# Altium schematic sheet DAC.SchDoc
size 558 x 431 mm; SheetNumber: 12; SheetTotal: 25; Sheet_Name: DAC; Size: 11x17
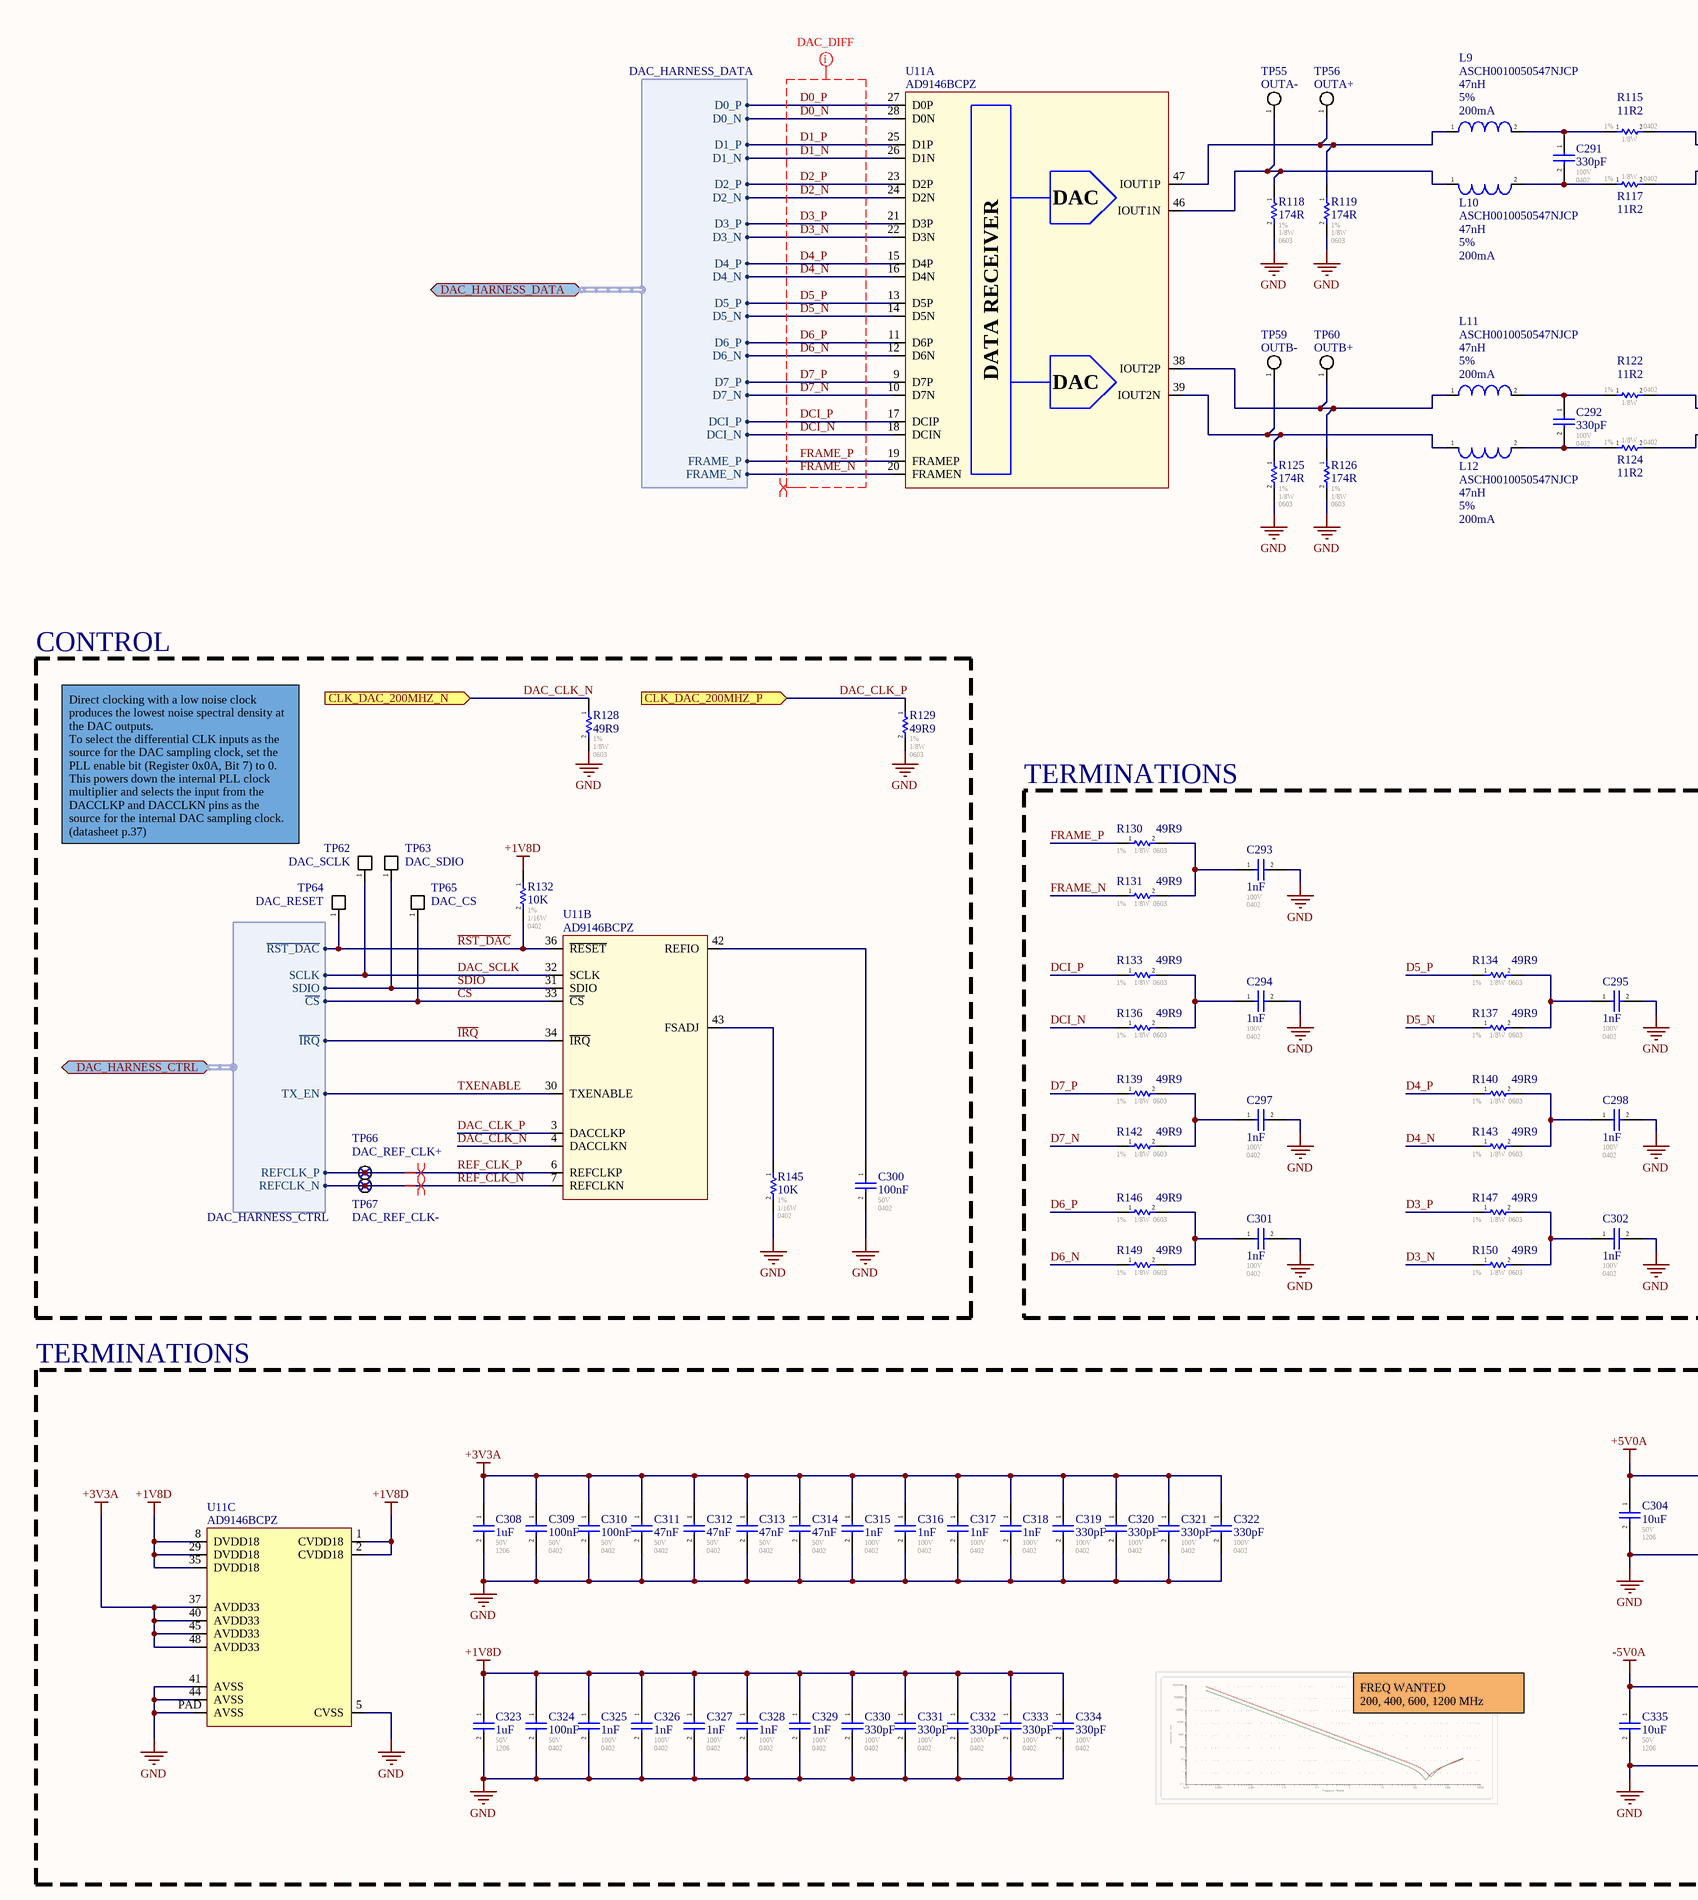
[diagram p0: DAC.SchDoc, left]
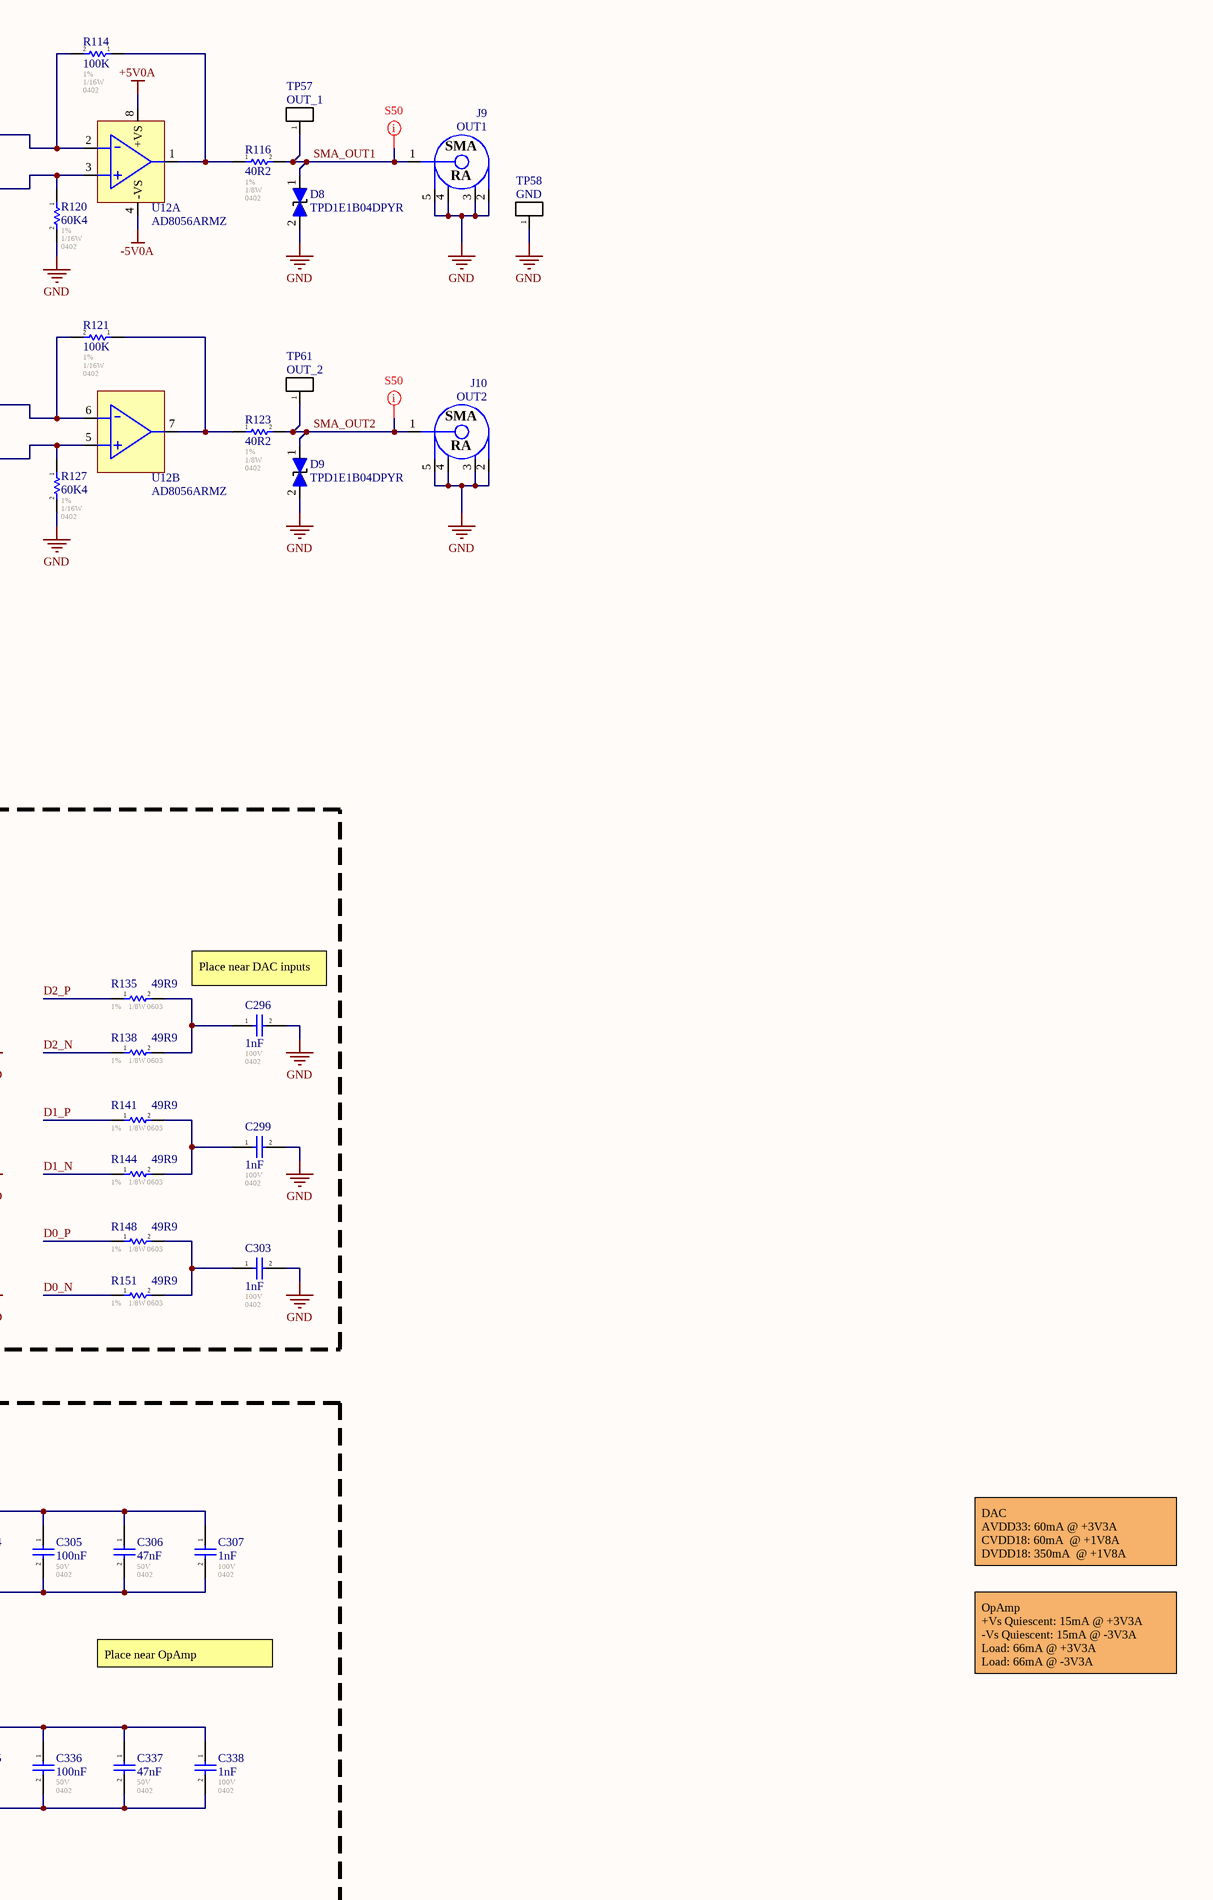
[diagram p1: DAC.SchDoc, right]

## Parts
C291  330pF  Voltage - Rated: 100V  Footprint: 0402  [CAP_0402]
C292  330pF  Voltage - Rated: 100V  Footprint: 0402  [CAP_0402]
C293  1nF  Voltage - Rated: 100V  Footprint: 0402  [CAP_0402]
C294  1nF  Voltage - Rated: 100V  Footprint: 0402  [CAP_0402]
C295  1nF  Voltage - Rated: 100V  Footprint: 0402  [CAP_0402]
C296  1nF  Voltage - Rated: 100V  Footprint: 0402  [CAP_0402]
C297  1nF  Voltage - Rated: 100V  Footprint: 0402  [CAP_0402]
C298  1nF  Voltage - Rated: 100V  Footprint: 0402  [CAP_0402]
C299  1nF  Voltage - Rated: 100V  Footprint: 0402  [CAP_0402]
C300  100nF  Voltage - Rated: 50V  Footprint: 0402  [CAP_0402]
C301  1nF  Voltage - Rated: 100V  Footprint: 0402  [CAP_0402]
C302  1nF  Voltage - Rated: 100V  Footprint: 0402  [CAP_0402]
C303  1nF  Voltage - Rated: 100V  Footprint: 0402  [CAP_0402]
C304  10uF  Voltage - Rated: 50V  Footprint: 1206  [CAP_1206]
C305  100nF  Voltage - Rated: 50V  Footprint: 0402  [CAP_0402]
C306  47nF  Voltage - Rated: 50V  Footprint: 0402  [CAP_0402]
C307  1nF  Voltage - Rated: 100V  Footprint: 0402  [CAP_0402]
C308  1uF  Voltage - Rated: 50V  Footprint: 1206  [CAP_1206]
C309  100nF  Voltage - Rated: 50V  Footprint: 0402  [CAP_0402]
C310  100nF  Voltage - Rated: 50V  Footprint: 0402  [CAP_0402]
C311  47nF  Voltage - Rated: 50V  Footprint: 0402  [CAP_0402]
C312  47nF  Voltage - Rated: 50V  Footprint: 0402  [CAP_0402]
C313  47nF  Voltage - Rated: 50V  Footprint: 0402  [CAP_0402]
C314  47nF  Voltage - Rated: 50V  Footprint: 0402  [CAP_0402]
C315  1nF  Voltage - Rated: 100V  Footprint: 0402  [CAP_0402]
C316  1nF  Voltage - Rated: 100V  Footprint: 0402  [CAP_0402]
C317  1nF  Voltage - Rated: 100V  Footprint: 0402  [CAP_0402]
C318  1nF  Voltage - Rated: 100V  Footprint: 0402  [CAP_0402]
C319  330pF  Voltage - Rated: 100V  Footprint: 0402  [CAP_0402]
C320  330pF  Voltage - Rated: 100V  Footprint: 0402  [CAP_0402]
C321  330pF  Voltage - Rated: 100V  Footprint: 0402  [CAP_0402]
C322  330pF  Voltage - Rated: 100V  Footprint: 0402  [CAP_0402]
C323  1uF  Voltage - Rated: 50V  Footprint: 1206  [CAP_1206]
C324  100nF  Voltage - Rated: 50V  Footprint: 0402  [CAP_0402]
C325  1nF  Voltage - Rated: 100V  Footprint: 0402  [CAP_0402]
C326  1nF  Voltage - Rated: 100V  Footprint: 0402  [CAP_0402]
C327  1nF  Voltage - Rated: 100V  Footprint: 0402  [CAP_0402]
C328  1nF  Voltage - Rated: 100V  Footprint: 0402  [CAP_0402]
C329  1nF  Voltage - Rated: 100V  Footprint: 0402  [CAP_0402]
C330  330pF  Voltage - Rated: 100V  Footprint: 0402  [CAP_0402]
C331  330pF  Voltage - Rated: 100V  Footprint: 0402  [CAP_0402]
C332  330pF  Voltage - Rated: 100V  Footprint: 0402  [CAP_0402]
C333  330pF  Voltage - Rated: 100V  Footprint: 0402  [CAP_0402]
C334  330pF  Voltage - Rated: 100V  Footprint: 0402  [CAP_0402]
C335  10uF  Voltage - Rated: 50V  Footprint: 1206  [CAP_1206]
C336  100nF  Voltage - Rated: 50V  Footprint: 0402  [CAP_0402]
C337  47nF  Voltage - Rated: 50V  Footprint: 0402  [CAP_0402]
C338  1nF  Voltage - Rated: 100V  Footprint: 0402  [CAP_0402]
D8  TPD1E1B04DPYR  [TVS_DATA_TPD1E1B04DPYR]
D9  TPD1E1B04DPYR  [TVS_DATA_TPD1E1B04DPYR]
J9  OUT1  [CONN_SMA_5-1814400-1]
J10  OUT2  [CONN_SMA_5-1814400-1]
L9  ASCH0010050547NJCP  Inductance: 47nH  Tolerance: 5%  Current Rating: 200mA  [IND_0402]
L10  ASCH0010050547NJCP  Inductance: 47nH  Tolerance: 5%  Current Rating: 200mA  [IND_0402]
L11  ASCH0010050547NJCP  Inductance: 47nH  Tolerance: 5%  Current Rating: 200mA  [IND_0402]
L12  ASCH0010050547NJCP  Inductance: 47nH  Tolerance: 5%  Current Rating: 200mA  [IND_0402]
R114  100K  Tolerance: 1%  Power: 1/16W  Package / Case: 0402  [RES_0402]
R115  11R2  Tolerance: 1%  Power: 1/8W  Package / Case: 0402  [RES_0402]
R116  40R2  Tolerance: 1%  Power: 1/8W  Package / Case: 0402  [RES_0402]
R117  11R2  Tolerance: 1%  Power: 1/8W  Package / Case: 0402  [RES_0402]
R118  174R  Tolerance: 1%  Power: 1/8W  Package / Case: 0603  [RES_0603]
R119  174R  Tolerance: 1%  Power: 1/8W  Package / Case: 0603  [RES_0603]
R120  60K4  Tolerance: 1%  Power: 1/16W  Package / Case: 0402  [RES_0402]
R121  100K  Tolerance: 1%  Power: 1/16W  Package / Case: 0402  [RES_0402]
R122  11R2  Tolerance: 1%  Power: 1/8W  Package / Case: 0402  [RES_0402]
R123  40R2  Tolerance: 1%  Power: 1/8W  Package / Case: 0402  [RES_0402]
R124  11R2  Tolerance: 1%  Power: 1/8W  Package / Case: 0402  [RES_0402]
R125  174R  Tolerance: 1%  Power: 1/8W  Package / Case: 0603  [RES_0603]
R126  174R  Tolerance: 1%  Power: 1/8W  Package / Case: 0603  [RES_0603]
R127  60K4  Tolerance: 1%  Power: 1/16W  Package / Case: 0402  [RES_0402]
R128  49R9  Tolerance: 1%  Power: 1/8W  Package / Case: 0603  [RES_0603]
R129  49R9  Tolerance: 1%  Power: 1/8W  Package / Case: 0603  [RES_0603]
R130  49R9  Tolerance: 1%  Power: 1/8W  Package / Case: 0603  [RES_0603]
R131  49R9  Tolerance: 1%  Power: 1/8W  Package / Case: 0603  [RES_0603]
R132  10K  Tolerance: 1%  Power: 1/16W  Package / Case: 0402  [RES_0402]
R133  49R9  Tolerance: 1%  Power: 1/8W  Package / Case: 0603  [RES_0603]
R134  49R9  Tolerance: 1%  Power: 1/8W  Package / Case: 0603  [RES_0603]
R135  49R9  Tolerance: 1%  Power: 1/8W  Package / Case: 0603  [RES_0603]
R136  49R9  Tolerance: 1%  Power: 1/8W  Package / Case: 0603  [RES_0603]
R137  49R9  Tolerance: 1%  Power: 1/8W  Package / Case: 0603  [RES_0603]
R138  49R9  Tolerance: 1%  Power: 1/8W  Package / Case: 0603  [RES_0603]
R139  49R9  Tolerance: 1%  Power: 1/8W  Package / Case: 0603  [RES_0603]
R140  49R9  Tolerance: 1%  Power: 1/8W  Package / Case: 0603  [RES_0603]
R141  49R9  Tolerance: 1%  Power: 1/8W  Package / Case: 0603  [RES_0603]
R142  49R9  Tolerance: 1%  Power: 1/8W  Package / Case: 0603  [RES_0603]
R143  49R9  Tolerance: 1%  Power: 1/8W  Package / Case: 0603  [RES_0603]
R144  49R9  Tolerance: 1%  Power: 1/8W  Package / Case: 0603  [RES_0603]
R145  10K  Tolerance: 1%  Power: 1/16W  Package / Case: 0402  [RES_0402]
R146  49R9  Tolerance: 1%  Power: 1/8W  Package / Case: 0603  [RES_0603]
R147  49R9  Tolerance: 1%  Power: 1/8W  Package / Case: 0603  [RES_0603]
R148  49R9  Tolerance: 1%  Power: 1/8W  Package / Case: 0603  [RES_0603]
R149  49R9  Tolerance: 1%  Power: 1/8W  Package / Case: 0603  [RES_0603]
R150  49R9  Tolerance: 1%  Power: 1/8W  Package / Case: 0603  [RES_0603]
R151  49R9  Tolerance: 1%  Power: 1/8W  Package / Case: 0603  [RES_0603]
TP55  OUTA-  [TP_PAD_SMALL]  (no BOM)
TP56  OUTA+  [TP_PAD_SMALL]  (no BOM)
TP57  OUT_1  [TP_HOLE]  (no BOM)
TP58  GND  [TP_HOLE]  (no BOM)
TP59  OUTB-  [TP_PAD_SMALL]  (no BOM)
TP60  OUTB+  [TP_PAD_SMALL]  (no BOM)
TP61  OUT_2  [TP_HOLE]  (no BOM)
TP62  DAC_SCLK  [TP_PAD]  (no BOM)
TP63  DAC_SDIO  [TP_PAD]  (no BOM)
TP64  DAC_RESET  [TP_PAD]  (no BOM)
TP65  DAC_CS  [TP_PAD]  (no BOM)
TP66  DAC_REF_CLK+  [TP_PAD_TINY]  (no BOM)
TP67  DAC_REF_CLK-  [TP_PAD_TINY]  (no BOM)
U11  AD9146BCPZ  [DAC_AD9146BCPZ]  (parts A,B,C of 3)
U12  AD8056ARMZ  [OPAMP_AD8056ARMZ]  (parts A,B of 2)

## Blocks framed on the sheet
CONTROL: C300 R128 R129 R132 R145 TP62-TP67 U11
TERMINATIONS: C293-C299 C301-C303 R130 R131 R133-R144 R146-R151
TERMINATIONS: C304-C338 U11

## Ports
CLK_DAC_200MHZ_N (in), CLK_DAC_200MHZ_P (in), DAC_HARNESS_CTRL (bidir, harness DAC_HARNESS_CTRL), DAC_HARNESS_DATA (bidir, harness DAC_HARNESS_DATA)

## Harnesses
DAC_HARNESS_DATA: D0_N, D0_P, D1_P, D1_N, D2_P, D2_N, D3_P, D3_N, D4_P, D4_N, D5_P, D5_N, D6_P, D6_N, D7_P, D7_N, DCI_P, DCI_N, FRAME_P, FRAME_N
DAC_HARNESS_CTRL: ~{RST_DAC}, SCLK, SDIO, ~{CS}, ~{IRQ}, TX_EN, REFCLK_P, REFCLK_N

## Nets
+1V8D: C323.1 C324.1 C325.1 C326.1 C327.1 C328.1 C329.1 C330.1 C331.1 C332.1 C333.1 C334.1 R132.1 U11.1(CVDD18) U11.2(CVDD18) U11.8(DVDD18) U11.29(DVDD18) U11.35(DVDD18)
+3V3A: C308.1 C309.1 C310.1 C311.1 C312.1 C313.1 C314.1 C315.1 C316.1 C317.1 C318.1 C319.1 C320.1 C321.1 C322.1 U11.37(AVDD33) U11.40(AVDD33) U11.45(AVDD33) U11.48(AVDD33)
+5V0A: C304.1 C305.1 C306.1 C307.1 U12.8(+VS)
-5V0A: C335.1 C336.1 C337.1 C338.1 U12.4(-VS)
GND: C293.2 C294.2 C295.2 C296.2 C297.2 C298.2 C299.2 C300.2 C301.2 C302.2 C303.2 C304.2 C305.2 C306.2 C307.2 C308.2 C309.2 C310.2 C311.2 C312.2 C313.2 C314.2 C315.2 C316.2 C317.2 C318.2 C319.2 C320.2 C321.2 C322.2 C323.2 C324.2 C325.2 C326.2 C327.2 C328.2 C329.2 C330.2 C331.2 C332.2 C333.2 C334.2 C335.2 C336.2 C337.2 C338.2 D8.2(i/o) D9.2(i/o) J9.2 J9.3 J9.4 J9.5 J10.2 J10.3 J10.4 J10.5 R118.2 R119.2 R120.2 R125.2 R126.2 R127.2 R128.2 R129.2 R145.2 TP58.1(A) U11.5(CVSS) U11.41(AVSS) U11.44(AVSS) U11.PAD(AVSS)
~{CS}: TP65.1(A) U11.33(~{CS}) ; port DAC_HARNESS_CTRL.~{CS}
~{IRQ}: U11.34(~{IRQ}) ; port DAC_HARNESS_CTRL.~{IRQ}
~{RST_DAC}: R132.2 TP64.1(A) U11.36(~{RESET}) ; port DAC_HARNESS_CTRL.~{RST_DAC}
D0_N: R151.1 U11.28(D0N) ; port DAC_HARNESS_DATA.D0_N
D0_P: R148.1 U11.27(D0P) ; port DAC_HARNESS_DATA.D0_P
D1_N: R144.1 U11.26(D1N) ; port DAC_HARNESS_DATA.D1_N
D1_P: R141.1 U11.25(D1P) ; port DAC_HARNESS_DATA.D1_P
D2_N: R138.1 U11.24(D2N) ; port DAC_HARNESS_DATA.D2_N
D2_P: R135.1 U11.23(D2P) ; port DAC_HARNESS_DATA.D2_P
D3_N: R150.1 U11.22(D3N) ; port DAC_HARNESS_DATA.D3_N
D3_P: R147.1 U11.21(D3P) ; port DAC_HARNESS_DATA.D3_P
D4_N: R143.1 U11.16(D4N) ; port DAC_HARNESS_DATA.D4_N
D4_P: R140.1 U11.15(D4P) ; port DAC_HARNESS_DATA.D4_P
D5_N: R137.1 U11.14(D5N) ; port DAC_HARNESS_DATA.D5_N
D5_P: R134.1 U11.13(D5P) ; port DAC_HARNESS_DATA.D5_P
D6_N: R149.1 U11.12(D6N) ; port DAC_HARNESS_DATA.D6_N
D6_P: R146.1 U11.11(D6P) ; port DAC_HARNESS_DATA.D6_P
D7_N: R142.1 U11.10(D7N) ; port DAC_HARNESS_DATA.D7_N
D7_P: R139.1 U11.9(D7P) ; port DAC_HARNESS_DATA.D7_P
DAC_CLK_N: R128.1 U11.4(DACCLKN) ; port CLK_DAC_200MHZ_N
DAC_CLK_P: R129.1 U11.3(DACCLKP) ; port CLK_DAC_200MHZ_P
DAC_SCLK: TP62.1(A) U11.32(SCLK) ; port DAC_HARNESS_CTRL.SCLK
DCI_N: R136.1 U11.18(DCIN) ; port DAC_HARNESS_DATA.DCI_N
DCI_P: R133.1 U11.17(DCIP) ; port DAC_HARNESS_DATA.DCI_P
FRAME_N: R131.1 U11.20(FRAMEN) ; port DAC_HARNESS_DATA.FRAME_N
FRAME_P: R130.1 U11.19(FRAMEP) ; port DAC_HARNESS_DATA.FRAME_P
REF_CLK_N: TP67.1(A) U11.7(REFCLKN) ; port DAC_HARNESS_CTRL.REFCLK_N
REF_CLK_P: TP66.1(A) U11.6(REFCLKP) ; port DAC_HARNESS_CTRL.REFCLK_P
SDIO: TP63.1(A) U11.31(SDIO) ; port DAC_HARNESS_CTRL.SDIO
SMA_OUT1: D8.1(i/o) J9.1 R116.2 TP57.1(A)
SMA_OUT2: D9.1(i/o) J10.1 R123.2 TP61.1(A)
TXENABLE: U11.30(TXENABLE) ; port DAC_HARNESS_CTRL.TX_EN
NetC291_1: C291.1 L9.2 R115.1
NetC291_2: C291.2 L10.2 R117.1
NetC292_1: C292.1 L11.2 R122.1
NetC292_2: C292.2 L12.2 R124.1
NetC293_1: C293.1 R130.2 R131.2
NetC294_1: C294.1 R133.2 R136.2
NetC295_1: C295.1 R134.2 R137.2
NetC296_1: C296.1 R135.2 R138.2
NetC297_1: C297.1 R139.2 R142.2
NetC298_1: C298.1 R140.2 R143.2
NetC299_1: C299.1 R141.2 R144.2
NetC300_1: C300.1 U11.42(REFIO)
NetC301_1: C301.1 R146.2 R149.2
NetC302_1: C302.1 R147.2 R150.2
NetC303_1: C303.1 R148.2 R151.2
NetL9_1: L9.1 R119.1 TP56.1(A) U11.47(IOUT1P)
NetL10_1: L10.1 R118.1 TP55.1(A) U11.46(IOUT1N)
NetL11_1: L11.1 R126.1 TP60.1(A) U11.38(IOUT2P)
NetL12_1: L12.1 R125.1 TP59.1(A) U11.39(IOUT2N)
NetR114_1: R114.1 R116.1 U12.1(OUT1)
NetR114_2: R114.2 R115.2 U12.2(-IN1)
NetR117_2: R117.2 R120.1 U12.3(+IN1)
NetR121_1: R121.1 R123.1 U12.7(OUT2)
NetR121_2: R121.2 R122.2 U12.6(-IN2)
NetR124_2: R124.2 R127.1 U12.5(+IN2)
NetR145_1: R145.1 U11.43(FSADJ)

## Layout directives
net class DAC_DIFF: D0_N, D0_P, D1_N, D1_P, D2_N, D2_P, D3_N, D3_P, D4_N, D4_P, D5_N, D5_P, D6_N, D6_P, D7_N, D7_P, DCI_N, DCI_P, FRAME_N, FRAME_P
differential pair: D0_N, D0_P, D1_N, D1_P, D2_N, D2_P, D3_N, D3_P, D4_N, D4_P, D5_N, D5_P, D6_N, D6_P, D7_N, D7_P, DCI_N, DCI_P, FRAME_N, FRAME_P, REF_CLK_N, REF_CLK_P
net class S50: SMA_OUT1, SMA_OUT2

## Notes on the sheet
- Direct clocking with a low noise clock produces the lowest noise spectral density at the DAC outputs.
  To select the differential CLK inputs as the source for the DAC sampling clock, set the PLL enable bit (Register 0x0A, Bit 7) to 0. This powers down the internal PLL clock multiplier and selects the input from the DACCLKP and DACCLKN pins as the source for the internal DAC sampling clock.
  (datasheet p.37)
- Place near DAC inputs
- DAC
  AVDD33: 60mA @ +3V3A
  CVDD18: 60mA  @ +1V8A
  DVDD18: 350mA  @ +1V8A
- Place near OpAmp
- OpAmp
  +Vs Quiescent: 15mA @ +3V3A
  -Vs Quiescent: 15mA @ -3V3A
  Load: 66mA @ +3V3A
  Load: 66mA @ -3V3A
- FREQ WANTED
  200, 400, 600, 1200 MHz
- Sheet Name
- Project Title
- Global Project
- Revision
- Size
- Date
- Group
- Sheet
- of
- Filename
- Designers
- (in symbol CONN_SMA_5-1814400-1) SMA; RA
- (in symbol DAC_AD9146BCPZ, part A) DAC; DATA RECEIVER

## Library data of the parts
C291 C292 C319-C322 C330-C334 = CAP_CER: GCM155R72A331KA37D / 0402 330pF 10% X7R Ceramic Capacitor; Mfr: Murata; Operating Temperature: -55C - 125C; Temperature Coefficient: X7R; ComponentLink1Description: Digikey; ComponentLink1URL: https://www.digikey.ca/en/products/detail/murata-electronics/GCM155R72A331KA37D/2591348; Part#: GCM155R72A331KA37D; ComponentLink2Description: Datasheet; ComponentLink2URL: https://search.murata.co.jp/Ceramy/image/img/A01X/G101/ENG/GCM155R72A331KA37-01A.pdf; Tolerance: 10%; Ratings: AEC-Q200; ComponentLink3Description: Murata; ComponentLink3URL: https://www.murata.com/en-us/products/productdetail?partno=GCM155R72A331KA37%23; ComponentLink4Description: Octopart; ComponentLink4URL: https://octopart.com/gcm155r72a331ka37d-murata-18331888?r=sp; Supplier 1: Arrow Electronics; Supplier Part Number 1: GCM155R72A331KA37D
C293-C299 C301-C303 C307 C315-C318 C325-C329 C338 = CAP_CER: GCM155R72A102KA37D / 0402 1nF 10% X7R Ceramic Capacitor; Mfr: Murata; Operating Temperature: -55C - 125C; Temperature Coefficient: X7R; ComponentLink1Description: Digikey; ComponentLink1URL: [Digikey Link]; Part#: GCM155R72A102KA37D; ComponentLink2Description: Datasheet; ComponentLink2URL: [Datasheet Link]; Tolerance: 10%; Ratings: AEC-Q200
C300 C305 C309 C310 C324 C336 = CAP_CER: GCM155R71H104KE02J / 0402 100nF 10% X7R Ceramic Capacitor; Mfr: Murata; Operating Temperature: -55C - 125C; Temperature Coefficient: X7R; ComponentLink1Description: Digikey; ComponentLink1URL: [Digikey Link]; Part#: GCM155R71H104KE02J; ComponentLink2Description: Datasheet; ComponentLink2URL: [Datasheet Link]; Tolerance: 10%; Ratings: AEC-Q200
C304 C335 = CAP_CER: GRT31CR61H106KE01L / 1206 10uF 10% X5R Ceramic Capacitor; Mfr: Murata; Operating Temperature: -55C - 85C; Temperature Coefficient: X5R; ComponentLink1Description: Digikey; ComponentLink1URL: [Digikey Link]; ComponentLink2Description: Datasheet; ComponentLink2URL: [Datasheet Link]; Tolerance: 10%; Ratings: AEC-Q200; Supplier 1: Arrow Electronics; Supplier Part Number 1: GRT31CR61H106KE01L; Part#: GRT31CR61H106KE01L
C306 C311-C314 C337 = CAP_CER: GCM155R71H473KE02J / 0402 47nF 10% X7R Ceramic Capacitor; Mfr: Murata; Operating Temperature: -55C - 125C; Temperature Coefficient: X7R; ComponentLink1Description: Digikey; ComponentLink1URL: [Digikey Link]; Part#: GCM155R71H473KE02J; ComponentLink2Description: Datasheet; ComponentLink2URL: [Datasheet Link]; Tolerance: 10%; Ratings: AEC-Q200
C308 C323 = CAP_CER: GCJ31CR71H105KA12L / 1206 1uF 10% X7R Ceramic Capacitor; Mfr: Murata; Operating Temperature: -55C - 125C; Temperature Coefficient: X7R; ComponentLink1Description: Digikey; ComponentLink1URL: [Digikey Link]; Part#: GCJ31CR71H105KA12L; ComponentLink2Description: Datasheet; ComponentLink2URL: [Datasheet Link]; Tolerance: 10%; Ratings: AEC-Q200
D8 D9 = TVS_DATA_TPD1E1B04DPYR: TVS - TVS DIODE 3.6V 8.5V - 0402; Manufacturer #1: Texas Instruments; Current Rating: 6.3Apeak; Power Max: 50Wpeak; GRAMS Lib Spec: 2.8; Magnetic Material: Unknown; Polarized: No; Value: *; Tolerance: *; Voltage Rating: 3.6V; HelpURL: http://www.ti.com/lit/ds/symlink/tpd1e1b04.pdf; CreatedBy/Date: Keven Deslandes - 2018/10/19; VerifiedBy: Caroline Paulin - 28 janv 2019; Temperature: -40°C ~ 125°C (TA); Package: 0402; Manufacturer #2: *; Note: *; Assembly Type: SMD; Part Number #2: *; Part Number #1: TPD1E1B04DPYR; Supplier 1: Digi-Key; Supplier Part Number 1: 296-47364-1-ND; Cryo: UNKNOWN
J9 J10 = CONN_SMA_5-1814400-1: 5-1814400-1 / CONN -  SMA JACK R/A 50 OHM - TH; Mfg: TE Connectivity AMP Connectors; Voltage: *; Current: *; Power: *; Mfg Part Number: 5-1814400-1; HelpURL: http://www.te.com/commerce/DocumentDelivery/DDEController?Action=srchrtrv&DocNm=1814400&DocType=Customer+Drawing&DocLang=English; CreatedBy: Jonathan Bouchard; Temperature: -55°C ~ 85°C; Value: *; Precision: *; Package: TH-5; Supplier 1: Digikey; Supplier Part Number 1: A97593-ND
L9-L12 = INDUCTOR: Generic Inductor; Material: Ceramic; Resistance: 2R; Q @ Freq: 8 @ 100MHz; Operating Temperature: -40C - 125C; Package / Case: 0402; Ratings: AEC-Q200; ComponentLink1Description: Digikey; ComponentLink1URL: https://www.digikey.ca/en/products/detail/pulse-electronics/asch00100505r10jcp/16503422; ComponentLink2Description: Datasheet; ComponentLink2URL: https://productfinder.pulseelectronics.com/api/open/part-attachments/datasheet/ASCH0010050547NJCP; ComponentLink3Description: Octopart; ComponentLink3URL: https://octopart.com/asch00100505r10jcp-pulse-128075794?r=sp; Supplier 1: Digikey; Supplier Part Number 1: 553-ASCH00100505R10JCPTR-ND
R114-R119 R121-R126 R128-R151 = RESISTOR: Automotive: AEC-Q200; Operating Temperature: *; # Digikey: *; ComponentLink1Description: Digikey; ComponentLink1URL: *; # Manufacturer: *
R120 R127 = RESISTOR: RMCF0402FT60K4; Automotive: AEC-Q200; Operating Temperature: *; # Digikey: *; ComponentLink1Description: Digikey; ComponentLink1URL: *; # Manufacturer: *
TP55 TP56 TP59 TP60 = TESTPOINT_PAD_SMALL: Test Point
TP57 TP58 TP61 = TESTPOINT: Test Point; ClassName: Testpoint
TP62-TP65 = TESTPOINT_PAD: Test Point
TP66 TP67 = TESTPOINT_PAD_TINY: Test Point
U11 = DAC_AD9146BCPZ: DAC - 16BIT SRL HIGH SPEED - QFN-48; Voltage: 3.13 V ~ 3.47 V / 1.71 V ~ 1.89 V; Mfg: Analog Devices Inc.; Current: *; Power: *; Mfg Part Number: AD9146BCPZ; HelpURL: http://www.analog.com/media/en/technical-documentation/data-sheets/AD9146.PDF; CreatedBy: Jonathan Bouchard; Temperature: -40°C ~ 85°C; Value: *; Precision: 16 Bit; Package: QFN-48; Supplier 1: Digikey; Supplier Part Number 1: AD9146BCPZ-ND
U12 = OPAMP_AD8056ARMZ: OPAMP - VFB 300MHZ - 8MSOP; Voltage: 8 V ~ 12 V, ±4 V ~ 6 V; Current: 60mA; Mfg: Analog Devices; Power: *; Mfg Part Number: AD8056ARMZ; HelpURL: http://www.analog.com/media/en/technical-documentation/data-sheets/AD8055_8056.pdf; CreatedBy: Jonathan Bouchard; Temperature: -40°C ~ 125°C; Value: *; Precision: *; Package: MSOP-8; Supplier 1: Digikey; Supplier Part Number 1: AD8056ARMZ-REEL7CT-ND